# EAGLE design Wireless_Steering_v3.4 (EAGLE 6.5.0)
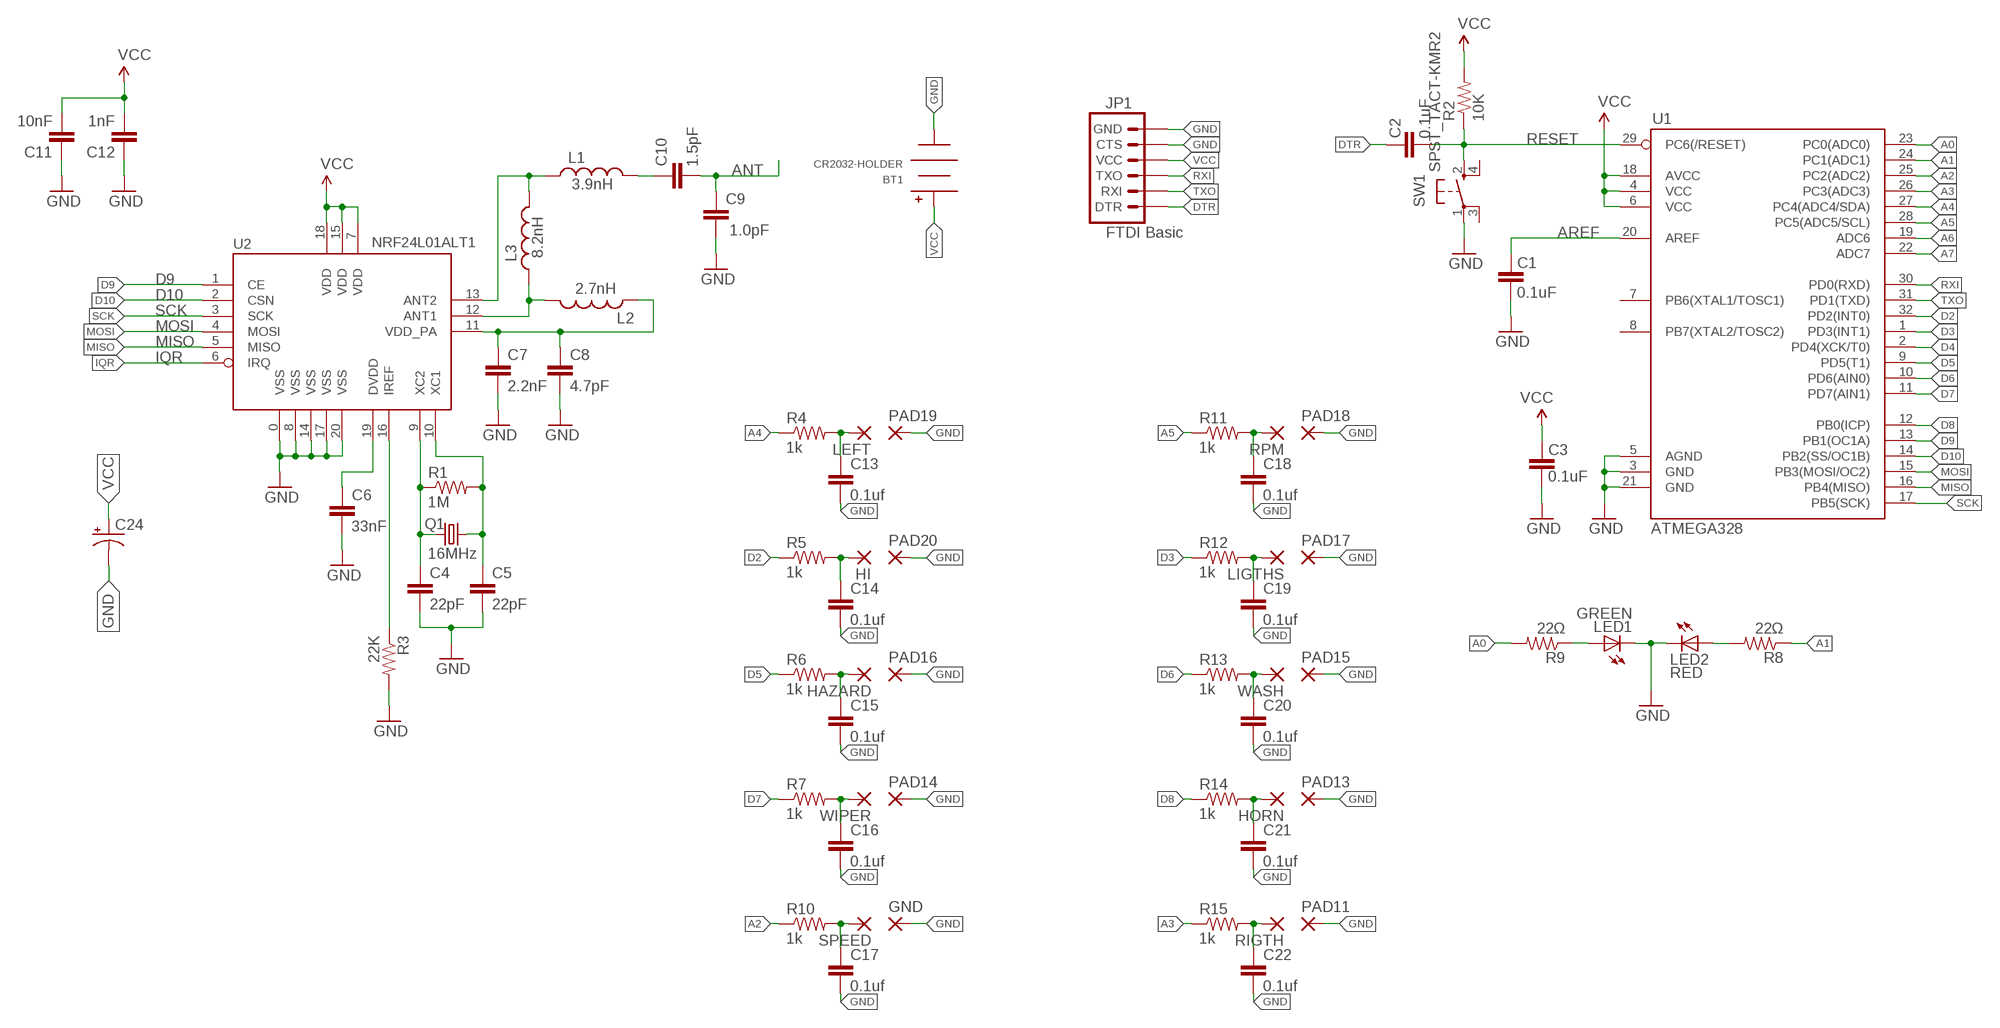
[diagram p0: schematic, sheet 1]

## Parts
BT1  CR2032-HOLDER  [CH28-2032LF]
C1  0.1uF  CAP0402-CAP  [0402-CAP]
C2  0.1uF  CAP0402-CAP  [0402-CAP]
C3  0.1uF  CAP0402-CAP  [0402-CAP]
C4  22pF  CAP0402-CAP  [0402-CAP]
C5  22pF  CAP0402-CAP  [0402-CAP]
C6  33nF  CAP0402-CAP  [0402-CAP]
C7  2.2nF  CAP0402-CAP  [0402-CAP]
C8  4.7pF  CAP0402-CAP  [0402-CAP]
C9  1.0pF  CAP0402-CAP  [0402-CAP]
C10  1.5pF  CAP0402-CAP  [0402-CAP]
C11  10nF  CAP0402-CAP  [0402-CAP]
C12  1nF  CAP0402-CAP  [0402-CAP]
C13  0.1uf  CAP0402-CAP  [0402-CAP]
C14  0.1uf  CAP0402-CAP  [0402-CAP]
C15  0.1uf  CAP0402-CAP  [0402-CAP]
C16  0.1uf  CAP0402-CAP  [0402-CAP]
C17  0.1uf  CAP0402-CAP  [0402-CAP]
C18  0.1uf  CAP0402-CAP  [0402-CAP]
C19  0.1uf  CAP0402-CAP  [0402-CAP]
C20  0.1uf  CAP0402-CAP  [0402-CAP]
C21  0.1uf  CAP0402-CAP  [0402-CAP]
C22  0.1uf  CAP0402-CAP  [0402-CAP]
C24  CAP_POL1206  [EIA3216]
GND  SMD2  [SMD1,27-2,54]
HAZARD  SMD2  [SMD1,27-2,54]
HI  SMD2  [SMD1,27-2,54]
HORN  SMD2  [SMD1,27-2,54]
JP1  FTDI Basic  ARDUINO_SERIAL_PROGRAMPTH  [1X06]
L1  3.9nH  INDUCTOR0402  [C0402]
L2  2.7nH  INDUCTOR0402  [C0402]
L3  8.2nH  INDUCTOR0402  [C0402]
LED1  GREEN  LEDCHIP-LED0603  [CHIP-LED0603]
LED2  RED  LEDCHIP-LED0603  [CHIP-LED0603]
LEFT  SMD2  [SMD1,27-2,54]
LIGTHS  SMD2  [SMD1,27-2,54]
PAD11  SMD2  [SMD1,27-2,54]
PAD13  SMD2  [SMD1,27-2,54]
PAD14  SMD2  [SMD1,27-2,54]
PAD15  SMD2  [SMD1,27-2,54]
PAD16  SMD2  [SMD1,27-2,54]
PAD17  SMD2  [SMD1,27-2,54]
PAD18  SMD2  [SMD1,27-2,54]
PAD19  SMD2  [SMD1,27-2,54]
PAD20  SMD2  [SMD1,27-2,54]
Q1  16MHz  CRYSTAL5X3  [CRYSTAL-SMD-5X3]
R1  1M  RESISTOR0402-RES  [0402-RES]
R2  10K  RESISTOR0402-RES  [0402-RES]
R3  22K  RESISTOR0402-RES  [0402-RES]
R4  1k  R-US_R0402  [R0402]
R5  1k  R-US_R0402  [R0402]
R6  1k  R-US_R0402  [R0402]
R7  1k  R-US_R0402  [R0402]
R8  22Ω  R-US_R0402  [R0402]
R9  22Ω  R-US_R0402  [R0402]
R10  1k  R-US_R0402  [R0402]
R11  1k  R-US_R0402  [R0402]
R12  1k  R-US_R0402  [R0402]
R13  1k  R-US_R0402  [R0402]
R14  1k  R-US_R0402  [R0402]
R15  1k  R-US_R0402  [R0402]
RIGTH  SMD2  [SMD1,27-2,54]
RPM  SMD2  [SMD1,27-2,54]
SPEED  SMD2  [SMD1,27-2,54]
SW1  SPST_TACT-KMR2  [KMR2]
U1  ATMEGA328  ATMEGA168  [TQFP32-08]
U2  NRF24L01ALT1  [QFN20_ALT1]
WASH  SMD2  [SMD1,27-2,54]
WIPER  SMD2  [SMD1,27-2,54]

## Nets
A0: R9.2 U1.23(PC0(ADC0))
A1: R8.1 U1.24(PC1(ADC1))
A2: R10.1 U1.25(PC2(ADC2))
A3: R15.1 U1.26(PC3(ADC3))
A4: R4.1 U1.27(PC4(ADC4/SDA))
A5: R11.1 U1.28(PC5(ADC5/SCL))
A6: U1.19(ADC6)
A7: U1.22(ADC7)
ANT: C9.2 C10.2
AREF: C1.2 U1.20(AREF)
D2: R5.1 U1.32(PD2(INT0))
D3: R12.1 U1.1(PD3(INT1))
D4: U1.2(PD4(XCK/T0))
D5: R6.1 U1.9(PD5(T1))
D6: R13.1 U1.10(PD6(AIN0))
D7: R7.1 U1.11(PD7(AIN1))
D8: R14.1 U1.12(PB0(ICP))
D9: U1.13(PB1(OC1A)) U2.1(CE)
D10: U1.14(PB2(SS/OC1B)) U2.2(CSN)
DTR: C2.2 JP1.1(DTR)
GND [vcc]: BT1.NEG C1.1 C3.1 C4.2 C5.2 C6.2 C7.2 C8.2 C9.1 C11.1 C12.1 C13.2 C14.2 C15.2 C16.2 C17.2 C18.2 C19.2 C20.2 C21.2 C22.2 C24.C(-) GND.1(P) JP1.5(CTS) JP1.6(GND) LED1.C LED2.C PAD11.1(P) PAD13.1(P) PAD14.1(P) PAD15.1(P) PAD16.1(P) PAD17.1(P) PAD18.1(P) PAD19.1(P) PAD20.1(P) R3.2 SW1.1(P) U1.3(GND) U1.5(AGND) U1.21(GND) U2.0(VSS) U2.8(VSS) U2.14(VSS) U2.17(VSS) U2.20(VSS)
IQR: U2.6(IRQ)
MISO: U1.16(PB4(MISO)) U2.5(MISO)
MOSI: U1.15(PB3(MOSI/OC2)) U2.4(MOSI)
N$1: C4.1 Q1.1 R1.1 U2.9(XC2)
N$2: C5.1 Q1.3 R1.2 U2.10(XC1)
N$8: L1.1 L3.2 U2.13(ANT2)
N$10: LED2.A R8.2
N$11: LED1.A R9.1
N$12: C7.1 C8.1 L2.1 U2.11(VDD_PA)
N$13: R3.1 U2.16(IREF)
N$14: C6.1 U2.19(DVDD)
N$15: L2.2 L3.1 U2.12(ANT1)
N$16: C10.1 L1.2
N$17: C13.1 LEFT.1(P) R4.2
N$18: C14.1 HI.1(P) R5.2
N$19: C16.1 R7.2 WIPER.1(P)
N$20: C17.1 R10.2 SPEED.1(P)
N$21: C22.1 R15.2 RIGTH.1(P)
N$22: C21.1 HORN.1(P) R14.2
N$23: C20.1 R13.2 WASH.1(P)
N$24: C19.1 LIGTHS.1(P) R12.2
N$25: C18.1 R11.2 RPM.1(P)
N$26: C15.1 HAZARD.1(P) R6.2
RESET: C2.1 R2.1 SW1.2(S) U1.29(PC6(/RESET))
RXI: JP1.3(TXO) U1.30(PD0(RXD))
SCK: U1.17(PB5(SCK)) U2.3(SCK)
TXO: JP1.2(RXI) U1.31(PD1(TXD))
VCC: BT1.POS C3.2 C11.2 C12.2 C24.A(+) JP1.4(VCC) R2.2 U1.4(VCC) U1.6(VCC) U1.18(AVCC) U2.7(VDD) U2.15(VDD) U2.18(VDD)
Unconnected: SW1.3(P1) SW1.4(S1) U1.7(PB6(XTAL1/TOSC1)) U1.8(PB7(XTAL2/TOSC2))

## Library data of the parts
BT1 = battery-holder:CR2032-HOLDER
C1-C22 = SparkFun:CAP: Capacitor Standard 0603 ceramic capacitor, and 0.1" leaded capacitor.
C24 = SparkFun-Passives:CAP_POL: Capacitor Polarized These are standard SMD and PTH capacitors. Normally 10uF, 47uF, and 100uF in electrolytic and tantalum varieties. Always verify the external diameter of the through hole cap, it varies with capacity, voltage, and manufacturer. The EIA devices should be standard.
GND HAZARD HI HORN LEFT LIGTHS PAD11 PAD13-PAD20 RIGTH RPM SPEED WASH WIPER = wirepad:SMD2: SMD PAD
JP1 = SparkFun:ARDUINO_SERIAL_PROGRAM
L1-L3 = SparkFun:INDUCTOR: Inductors Basic Inductor/Choke - 0603 and 1206. Footprints are not proven and vary greatly between part numbers.
LED1 LED2 = adafruit:LED: LED OSRAM: - CHIPLED LG R971, LG N971, LY N971, LG Q971, LY Q971, LO R971, LY R971 LH N974, LH R974 LS Q976, LO Q976, LY Q976 LO Q996 - Hyper CHIPLED LW Q18S LB Q993, LB Q99A, LB R99A - SideLED LS A670, LO A670, LY A670, LG A670, LP A670 LB A673, LV A673, LT A673, LW A673 LH A674 LY A675 LS A676, LA A676, LO A676, LY A676, LW A676 LS A679, LY A679, LG A679 - Hyper Micro SIDELED® LS Y876, LA Y876, LO Y876, LY Y876 LT Y87S - SmartLED LW L88C, LW L88S LB L89C, LB L89S, LG L890 LS L89K, LO L89K, LY L89K LS L896, LA L896, LO L896, LY L896 - TOPLED LS T670, LO T670, LY T670, LG T670, LP T670 LSG T670, LSP T670, LSY T670, LOP T670, LYG T670 LG T671, LOG T671, LSG T671 LB T673, LV T673, LT T673, LW T673 LH T674 LS T676, LA T676, LO T676, LY T676, LB T676, LH T676, LSB T676, LW T676 LB T67C, LV T67C, LT T67C, LS T67K, LO T67K, LY T67K, LW E67C LS E67B, LA E67B, LO E67B, LY E67B, LB E67C, LV E67C, LT E67C LW T67C LS T679, LY T679, LG T679 LS T770, LO T770, LY T770, LG T770, LP T770 LB T773, LV T773, LT T773, LW T773 LH T774 LS E675, LA E675, LY E675, LS T675 LS T776, LA T776, LO T776, LY T776, LB T776 LHGB T686 LT T68C, LB T68C - Hyper Mini TOPLED® LB M676 - Mini TOPLED Santana® LG M470 LS M47K, LO M47K, LY M47K Source: http://www.osram.convergy.de/
Q1 = SparkFun:CRYSTAL: Crystals Various standard crystals. Proven footprints. Spark Fun Electronics SKU : COM-00534
R1-R3 = SparkFun:RESISTOR: Resistor Basic schematic elements and footprints for 0603, 1206, and PTH resistors.
R4-R15 = adafruit:R-US_: RESISTOR, American symbol
SW1 = adafruit:SPST_TACT: SMT 6mm switch, EVQQ2 series http://www.ladyada.net/library/eagle
U1 = SparkFun:ATMEGA168
U2 = Testing:NRF24L01: 2.4GHz Low Power Transceiver This is the very popular, low cost, very low power RF transceiver from Nordic Semiconductor. Simple SPI interface. SKU: COM-00690

## Net classes
1 vcc: width 0.254 mm

## Board
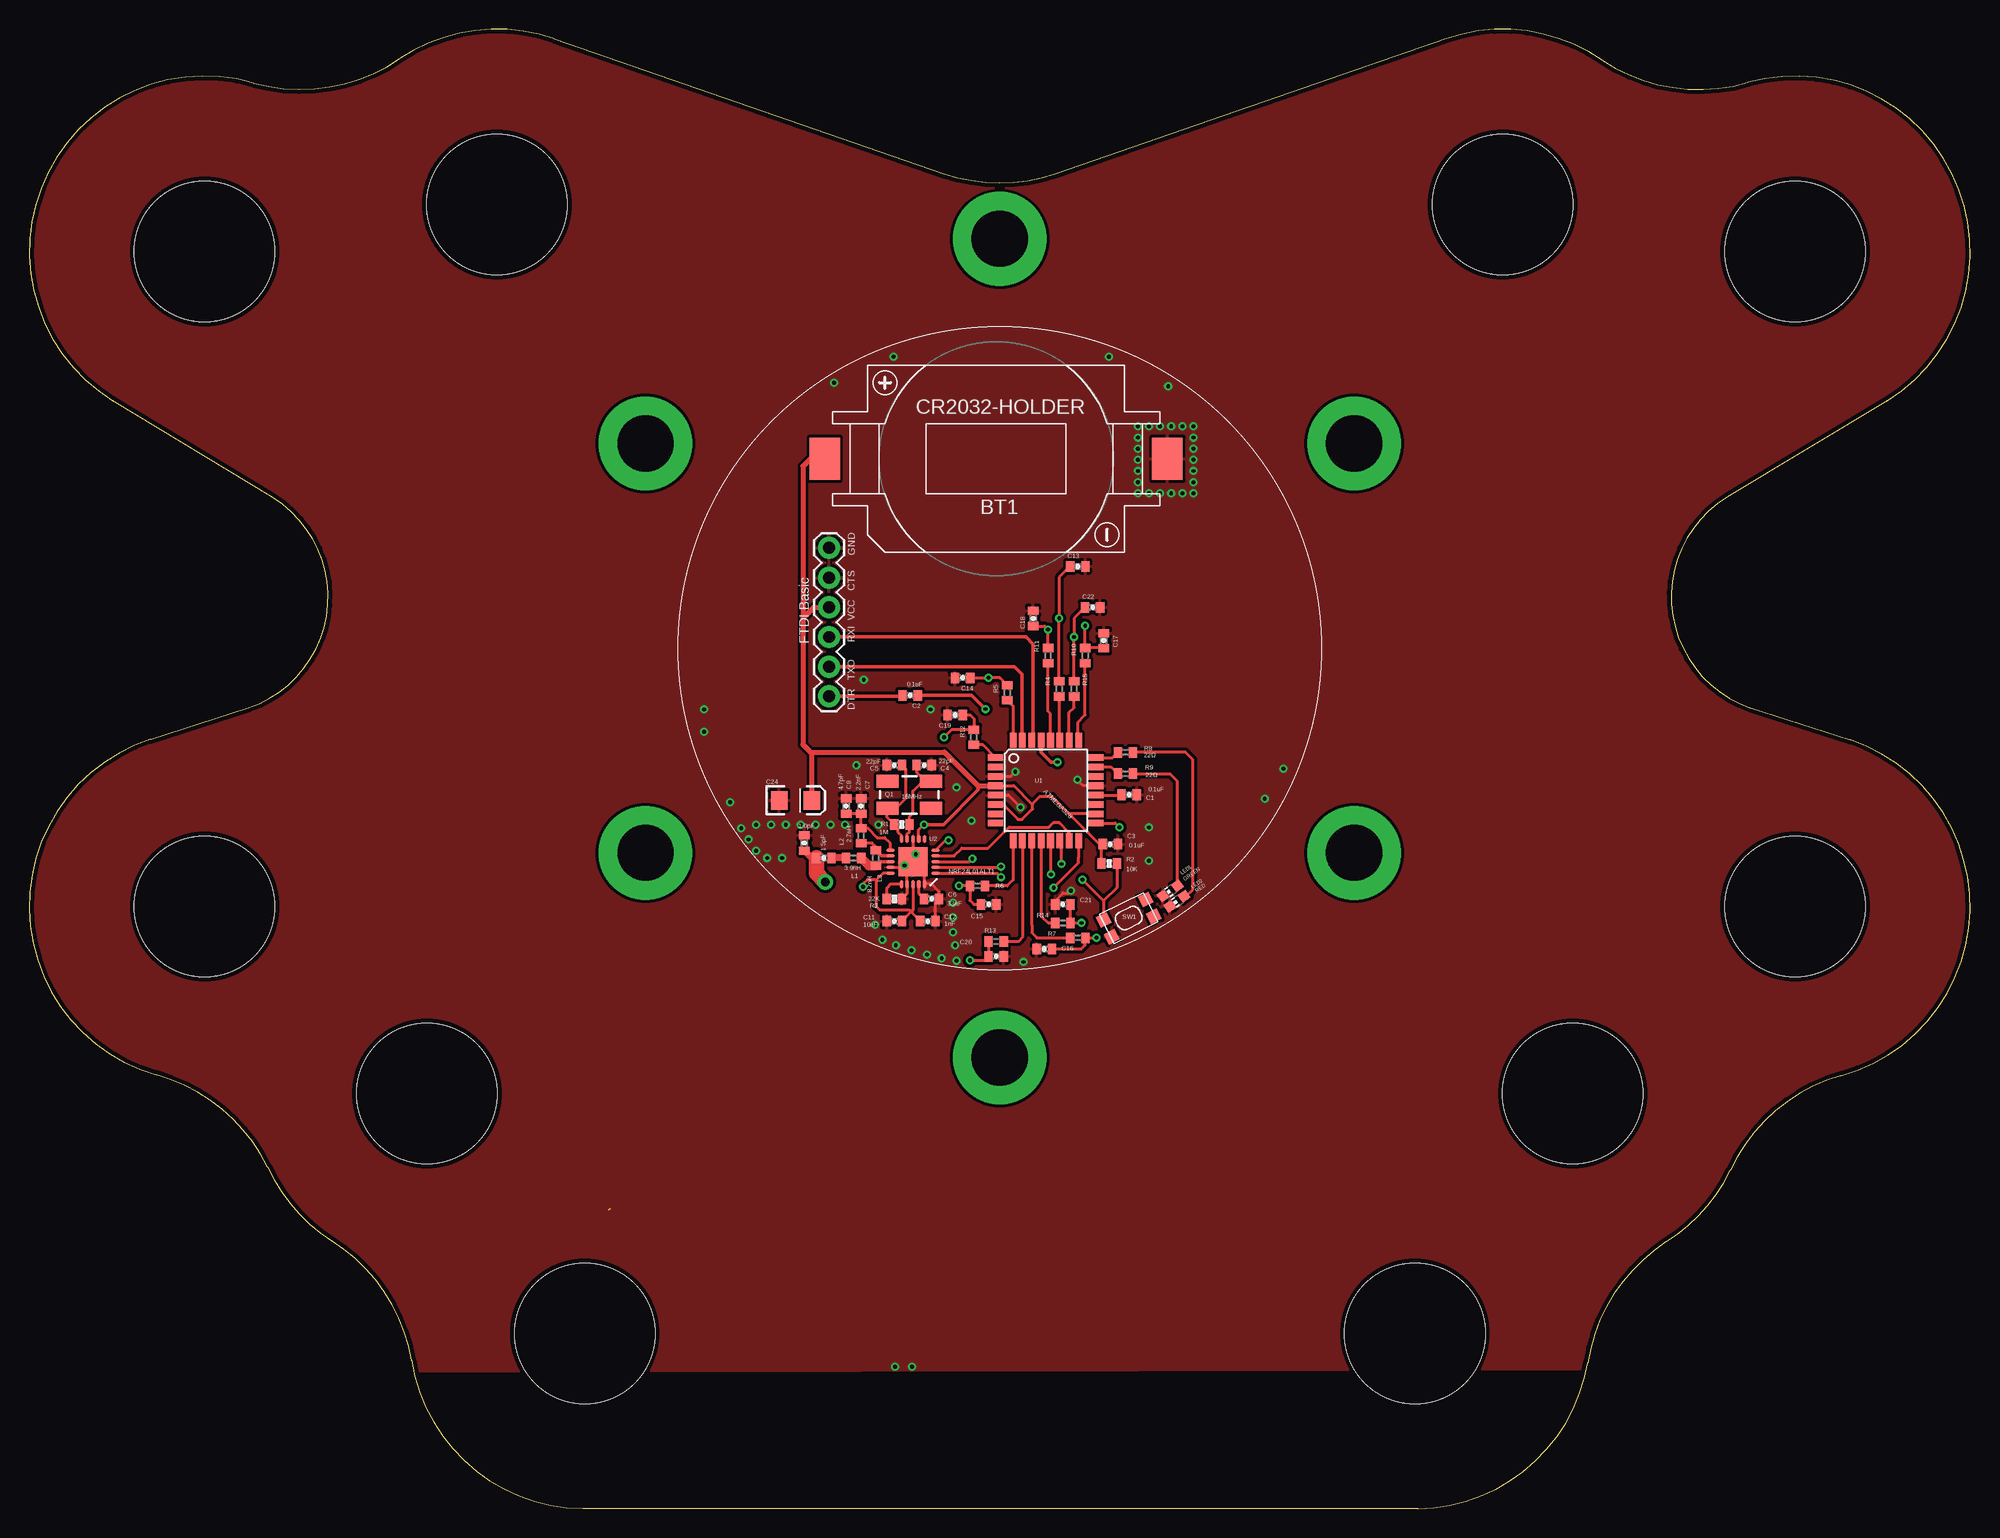
[diagram p1: board, top side]
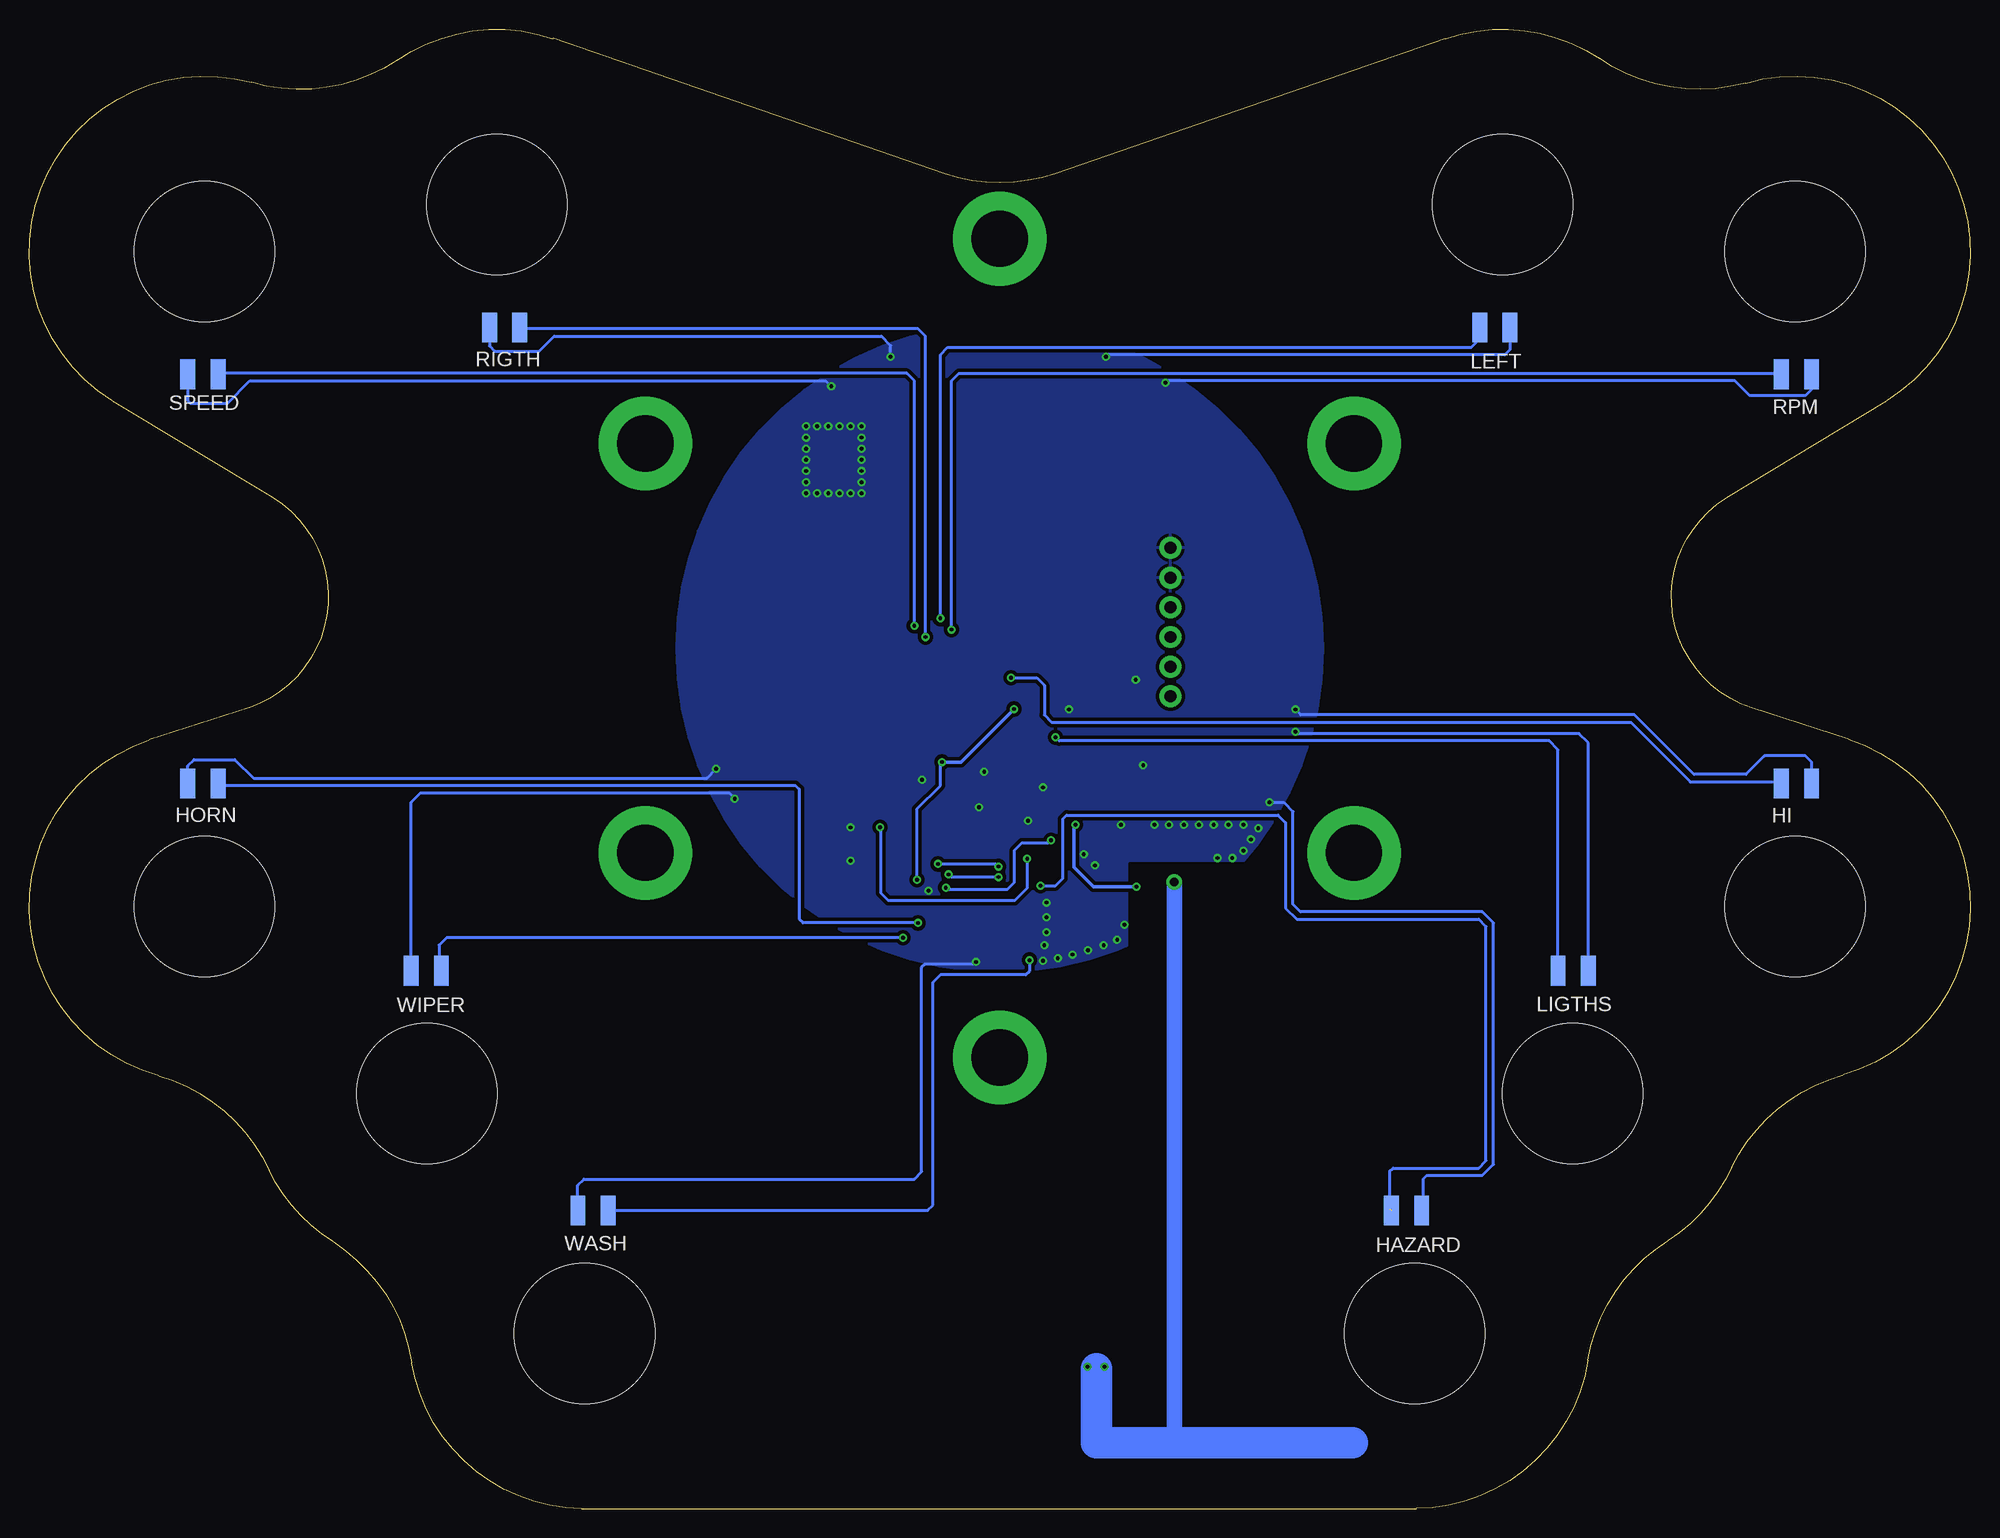
[diagram p2: board, bottom side, seen from below]

Size 166 x 126.49 mm. Coordinates in mm from the lower left corner, seen from the top.
Outline: 147.17,68.5 155.73,65.73
Outline: 121.21,125.7 87.71,114.12 arc-37 78.23,114.15 44.91,125.68 arc53 31.7,124
Outline: 47.37,0 118.74,0 arc79 133.29,12.5
Outline: 20.85,86.44 7.14,94.72
Outline: 155.72,65.73 arc-146 154.94,37.03 arc49 145.48,28.94
Outline: 7.15,94.73 arc-165 19.2,121.9 arc50 31.71,123.99
Outline: 146.99,121.95 arc-50 134.54,123.83 arc53 121.21,125.7
Outline: 146.99,121.94 arc-164 158.9,94.74 145.16,86.46 arc129 147.16,68.49
Outline: 145.48,28.94 arc-32 139.98,22.81 arc48 133.29,12.5
Outline: 47.37,0.02 arc-81 32.69,12.7 arc48 25.86,22.91
Outline: 25.86,22.91 arc-32 20.4,29.19 arc49 10.87,37.09
Outline: 10.87,37.09 arc-146 10.39,65.79 18.74,68.48 arc130 20.85,86.43
Copper layers (1*16): Top 0.0356mm / dielectric 1.5011mm / Bottom 0.0356mm
Design rules "oshpark-2layer": minimum track width 6mil, minimum drill 13mil, track to track 6mil, track to pad 6mil, pad to pad 6mil, via to via 6mil, smd to smd 6mil, copper to edge 15mil, drill to drill 6mil, minimum pad ring 7mil, minimum via ring 7mil, stop-mask expansion 2.5mil, vias tented up to drill 0mil, thermal gap 10mil
Holes 12 mm at 15,107.5 40,111.5 126,111.5 151,107.5 151,51.5 132,35.5 15,51.5 34,35.5 47.5,15 118.5,15

### Footprints (pad centres in the part's own frame; a part is rotated, then mirrored left to right if it is on the bottom)
CH28-2032LF = smd 3.6 x 2.6: NEG 0,-14.65; POS 0,14.65
0402-CAP = smd 0.7 x 0.9: 1 -0.65,0; 2 0.65,0
EIA3216 = smd 1.4 x 1.6: A 1.4,0; C -1.4,0
SMD1,27-2,54 = smd 1.27 x 2.54: 1 0,0
1X06 = drill 1.016 pad 1.88: 1 0,0; 2 2.54,0; 3 5.08,0; 4 7.62,0; 5 10.16,0; 6 12.7,0
C0402 = smd 0.7 x 0.9: 1 -0.65,0; 2 0.65,0
CHIP-LED0603 = smd 0.8 x 0.8: A 0,-0.75; C 0,0.75
CRYSTAL-SMD-5X3 = smd 1.9 x 1.1: 1 -1.85,-1.15; 2 1.85,-1.15; 3 1.85,1.15; 4 -1.85,1.15
0402-RES = smd 0.7 x 0.9: 1 -0.65,0; 2 0.65,0
R0402 = smd 0.7 x 0.9: 1 -0.65,0; 2 0.65,0
KMR2 = smd 1 x 1: 1 2,0.8; 2 2,-0.8; 3 -2,0.8; 4 -2,-0.8
TQFP32-08 = smd 1.27 x 0.559: 1 -4.293,2.8; 2 -4.293,2; 3 -4.293,1.2; 4 -4.293,0.4; 5 -4.293,-0.4; 6 -4.293,-1.2; 7 -4.293,-2; 8 -4.293,-2.8; 17 4.293,-2.8; 18 4.293,-2; 19 4.293,-1.2; 20 4.293,-0.4; 21 4.293,0.4; 22 4.293,1.2; 23 4.293,2; 24 4.293,2.8 | smd 0.559 x 1.27: 9 -2.8,-4.293; 10 -2,-4.293; 11 -1.2,-4.293; 12 -0.4,-4.293; 13 0.4,-4.293; 14 1.2,-4.293; 15 2,-4.293; 16 2.8,-4.293; 25 2.8,4.293; 26 2,4.293; 27 1.2,4.293; 28 0.4,4.293; 29 -0.4,4.293; 30 -1.2,4.293; 31 -2,4.293; 32 -2.8,4.293
QFN20_ALT1 = smd 2.515 x 2.515: 0 0,0 | smd 0.686 x 0.293: 1 -1.925,0.986; 2 -1.925,0.493; 3 -1.925,0; 4 -1.925,-0.493; 5 -1.925,-0.986; 11 1.925,-0.986; 12 1.925,-0.493; 13 1.925,0; 14 1.925,0.493; 15 1.925,0.986 | smd 0.293 x 0.686: 6 -0.986,-1.925; 7 -0.493,-1.925; 8 0,-1.925; 9 0.493,-1.925; 10 0.986,-1.925; 16 0.986,1.925; 17 0.493,1.925; 18 0,1.925; 19 -0.493,1.925; 20 -0.986,1.925

### Placement (x,y rotation side)
BT1  82.68,89.77 90 top
C1  94.06,61.05 180 top
C2  75.34,69.55 180 top
C3  92.45,56.82 180 top
C4  76.53,63.57 0 top
C5  73.99,63.57 180 top
C6  77.17,52.14 0 top
C7  71.14,60.08 90 top
C8  69.86,60.08 90 top
C9  66.29,56.92 270 top
C10  67.96,55.64 180 top
C11  73.99,50.24 0 top
C12  76.85,50.24 180 top
C13  89.67,80.56 0 top
C14  79.82,71.04 180 top
C15  82.05,51.67 0 top
C16  86.81,47.86 180 top
C17  91.89,74.22 90 top
C18  85.86,76.12 90 top
C19  79.19,67.86 180 top
C20  82.68,47.23 0 top
C21  88.4,51.67 180 top
C22  90.94,77.07 0 top
C24  65.54,60.56 0 top
GND  13.57,97 0 bottom
HAZARD  49.5,25.5 0 bottom
HI  16.15,62 0 bottom
HORN  149.85,62 0 bottom
JP1  68.39,69.45 90 top
L1  70.5,55.64 180 top
L2  71.14,57.54 270 top
L3  72.4,55.64 270 top
LED1  97.57,52.83 125 top
LED2  98.15,51.93 125 top
LEFT  41.95,101 0 bottom
LIGTHS  35.25,46 0 bottom
PAD11  119.08,25.5 0 bottom
PAD13  133.33,46 0 bottom
PAD14  152.43,62 0 bottom
PAD15  13.57,62 0 bottom
PAD16  32.67,46 0 bottom
PAD17  46.92,25.5 0 bottom
PAD18  152.43,97 0 bottom
PAD19  126.63,101 0 bottom
PAD20  39.37,101 0 bottom
Q1  75.26,61.03 180 top
R1  74.63,58.49 180 top
R2  92.36,55.16 180 top
R3  73.99,52.14 0 top
R4  88.08,70.09 90 top
R5  83.63,69.77 90 top
R6  81.09,53.26 180 top
R7  89.67,48.81 0 top
R8  93.75,64.67 0 top
R9  93.75,62.84 180 top
R10  90.3,72.94 90 top
R11  87.13,72.94 90 top
R12  80.78,65.96 90 top
R13  82.68,48.5 180 top
R14  88.4,50.09 0 top
R15  89.35,70.09 90 top
RIGTH  124.05,101 0 bottom
RPM  16.15,97 0 bottom
SPEED  149.85,97 0 bottom
SW1  94.03,50.5 206 top
U1  86.94,61.42 0 top
U2  75.58,55.32 180 top
WASH  116.5,25.5 0 bottom
WIPER  130.75,46 0 bottom

### Tracks (layer width: path | path; a pad name or v marks a point on that pad's centre or on a via)
A0
  Top 0.254: U1.23 91.25,63.44 92.5,63.44 R9.2
A1
  Top 0.254: U1.24 92.64,64.22 R8.1
A2
  Top 0.254: U1.25 89.67,65.78 89.67,67.23 90.3,67.86 R10.1
A3
  Top 0.254: U1.26 88.94,68.09 89.35,68.5 R15.1
A4
  Top 0.254: R4.1 88.08,65.76 U1.27
A5
  Top 0.254: U1.28 87.34,67.97 87.13,68.18 R11.1
ANT  (via drill 0.7 pad 1.35)
  Top 0.61: C10.2 66.92,55.64 C9.2
  Top 1.346: C10.2 67.31,54.35 v68.08,53.58
  Bottom 1.346: 68.08,5.63 v68.08,53.58
  Bottom 2.7: 52.84,5.63 68.08,5.63 74.74,5.63 74.74,11.98
AREF
  Top 0.254: U1.20 93.18,61.02 C1.2
D2
  Top 0.254: 84.14,66.01 U1.32 84.14,68.62 R5.1
D3
  Top 0.254: U1.1 81.55,65.31 R12.1
D5
  Top 0.254: U1.9 84.14,53.76 83.63,53.26 R6.1
D6
  Top 0.254: U1.10 84.94,48.85 84.59,48.5 R13.1
D7
  Top 0.254: U1.11 85.74,49.89 85.74,49.25 86.17,48.81 R7.1
D8
  Top 0.254: U1.12 86.54,51.31 86.54,50.68 87.13,50.09 R14.1
D9  (via drill 0.33)
  Top 0.254: U2.1 82.79,54.33 v83.12,54.01 | v87.38,54.23 87.38,57.07 U1.13
  Bottom 0.254: v83.12,54.01 87.16,54.01 v87.38,54.23
D10  (via drill 0.33)
  Top 0.254: U2.2 83.04,54.83 v83.12,54.91 | v88.28,55.13 88.28,56.98 U1.14
  Bottom 0.254: v88.28,55.13 83.34,55.13 v83.12,54.91
DTR
  Top 0.305: C2.2 74.39,69.45 JP1.1
GND  (via drill 0.33)
  Top 0.254: R3.2 75.09,52.59 U2.17 75.09,54.83 | C12.1 77.5,51.83 C6.2 77.82,52.76 77.17,53.41 76.59,53.41 U2.20 76.57,54.33 U2.0 | 75.09,54.83 U2.0 | U2.14 75.09,54.83 | U2.8 U2.0 | U1.3 83.93,62.62 v84.33,63.01 | U1.5 83.74,61.02 v84.78,59.98 | U1.21 90.13,61.81 v89.63,62.31 | C21.2 87.75,51.98 88.4,52.62 88.86,52.62 v89.09,52.85
  Bottom 0.254: PAD20.1 39.37,99.11 39.82,98.66 73.75,98.66 v73.91,98.5 | GND.1 13.57,95.7 14.1,95.17 18.86,95.17 20.13,96.44 68.67,96.44 v68.83,96.28 | PAD19.1 126.63,99.43 126.18,98.98 122.37,98.98 121.1,100.25 93.12,100.25 92.32,99.45 v92.32,98.5 | PAD18.1 152.43,94.75 152.21,94.53 149.04,94.53 147.13,96.44 97.89,96.44 v97.4,95.96 | PAD14.1 152.43,63.52 151.9,64.06 148.4,64.06 146.82,62.47 108.04,62.47 v107.25,63.26 | PAD13.1 133.33,60.4 132.53,61.2 106.14,61.2 v105.66,60.72 | v59.94,60.4 58.71,60.4 57.92,59.61 57.92,51.67 57.28,51.04 41.72,51.04 40.77,50.09 40.77,29.45 41.72,28.49 46.49,28.49 46.8,28.18 46.8,25.62 PAD17.1 | PAD15.1 13.57,63.84 14.1,64.37 17.59,64.37 19.18,62.78 23.63,62.78 28.71,67.86 57.24,67.86 v57.72,68.34 | PAD16.1 32.67,65.48 33.47,66.28 57.56,66.28 v57.72,66.43 | PAD11.1 119.08,27.66 118.56,28.18 90.3,28.18 89.67,28.81 89.67,46.27 89.35,46.59 85.18,46.59 v85.02,46.75
  other vias: 80.58,58.81 95.76,58.25 95.76,55.39 79.31,61.67 71.37,70.88 77.08,68.34 70.73,63.57 74.11,48.18 68.51,58.49 75.81,55.95 74.86,55 78.99,50.56 76.77,47.38 78.04,47.06 78.99,49.29 79.31,46.85 72.96,48.65 60.89,58.18 61.53,57.22 62.16,56.27 63.11,55.64 64.38,55.64 62.16,58.49 63.43,58.49 64.7,58.49 97.66,86.82 98.61,86.82 99.57,86.82 99.57,87.77 99.57,88.73 99.57,89.68 99.57,90.63 99.57,91.58 99.57,92.54 98.61,92.54 97.66,92.54 96.71,92.54 95.76,92.54 94.8,92.54 94.8,91.58 94.8,90.63 94.8,89.68 94.8,88.73 94.8,87.77 94.8,86.82 95.76,86.82 96.71,86.82 75.45,47.75 79.19,48.18 74.05,12.14 75.5,12.14 65.97,58.49 67.24,58.49 69.78,58.49 72.32,49.92 78.99,51.83 72.64,58.49
  pour Top (isolate 0.305, rank 2): 82.88,101.2 83.12,101.2 arc-90
  pour Bottom (isolate 0.305, rank 2): 83.12,45.96 82.88,45.96 arc-90 55.38,73.46 55.38,73.7 arc-90 82.88,101.2 83.12,101.2 arc-90 110.62,73.7 110.62,73.46 arc-90
  pour Top (isolate 0.254, rank 2): -0.19,126.6 166.18,126.92 166.18,11.98 -0.19,11.67
MISO  (via drill 0.33)
  Top 0.254: v78.63,57.15 78.35,57.15 U2.5 | U1.16 89.74,55.68 89.74,55.23 v87.61,53.11
  Bottom 0.254: v78.63,57.15 78.85,56.92 81.1,56.92 81.77,56.25 81.77,53.53 82.36,52.94 87.44,52.94 v87.61,53.11
MOSI
  Top 0.254: U1.15 88.94,57.8 88.1,58.63 87.56,58.63 87.2,58.27 83.79,58.27 82,56.48 79.75,56.48 79.09,55.81 U2.4
N$1
  Top 0.254: U2.9 75.09,57.68 75.26,57.86 75.26,58.48 R1.1 75.28,59.14 75.58,59.45 75.58,61.35 76.53,62.3 | 76.53,62.3 76.99,62.3 Q1.1 | C4.1 75.88,62.95 76.53,62.3
N$2
  Top 0.254: U2.10 74.59,57.58 74.31,57.86 74.31,58.16 R1.2 73.98,58.51 73.36,59.13 73.36,59.83 Q1.3 73.61,60.08 74.31,60.08 74.94,60.72 74.94,63.26 C5.1
N$3  (via drill 4.8 pad 8)
  other vias: 83,108.58
N$4  (via drill 4.8 pad 8)
  other vias: 113.3,91.08
N$5  (via drill 4.8 pad 8)
  other vias: 52.7,91.08
N$6  (via drill 4.8 pad 8)
  other vias: 52.7,56.08
N$7  (via drill 4.8 pad 8)
  other vias: 113.3,56.08
N$8
  Top 0.254: 72.42,55 L3.2
  Top 0.305: U2.13 72.74,55.32 L3.2
  Top 0.813: L3.2 71.8,54.99 L1.1
N$9  (via drill 4.8 pad 8)
  other vias: 83,38.58
N$10
  Top 0.254: LED2.A 98.93,52.36 99.51,52.94 99.51,64.06 98.87,64.69 94.42,64.69 R8.2
N$11
  Top 0.254: LED1.A 98.19,62.2 97.6,62.78 94.46,62.78 R9.1
N$12
  Top 0.254: C8.1 C7.1 L2.1 71.72,58.19 72.52,57.39 73.16,57.39 73.65,56.89 U2.11
N$13
  Top 0.254: R3.1 73.34,53.08 73.67,53.41 74.57,53.41 U2.16
N$14
  Top 0.254: U2.19 76.07,52.59 C6.1
N$15
  Top 0.254: L3.1 72.4,56.59 72.09,56.91 71.15,56.91 L2.2
  Top 0.305: U2.12 72.88,55.81 L3.1
N$16
  Top 0.61: L1.2 C10.1
N$17  (via drill 0.33)
  Top 0.254: R4.2 v88.08,76.12 88.08,79.63 C13.1
  Bottom 0.254: v88.08,76.12 88.08,98.66 87.44,99.3 42.68,99.3 42.04,99.93 42.04,100.91 LEFT.1
N$18  (via drill 0.33)
  Top 0.254: R5.2 83.62,70.42 83,71.04 v82.05,71.04 C14.1
  Bottom 0.254: v82.05,71.04 79.82,71.04 79.19,70.41 79.19,67.86 78.55,67.23 29.02,67.23 23.94,62.15 16.3,62.15 HI.1
N$19  (via drill 0.33)
  Top 0.254: v91.25,48.81 R7.2 90.3,48.8 90.3,48.18 89.98,47.86 C16.1
  Bottom 0.254: 130.62,45.88 WIPER.1 | 130.62,46.12 WIPER.1 | v91.25,48.81 130.31,48.81 130.94,48.18 130.94,46.19 WIPER.1
N$20  (via drill 0.33)
  Top 0.254: v90.3,75.48 R10.2 91.86,73.59 C17.1
  Bottom 0.254: v90.3,75.48 90.3,96.44 90.94,97.08 149.77,97.08 SPEED.1
N$21  (via drill 0.33)
  Top 0.254: R15.2 v89.35,74.53 89.35,76.14 C22.1
  Bottom 0.254: v89.35,74.53 89.35,100.25 89.98,100.88 123.93,100.88 RIGTH.1
N$22  (via drill 0.33)
  Top 0.254: v89.98,50.09 R14.2 C21.1
  Bottom 0.254: v89.98,50.09 99.83,50.09 100.14,50.4 100.14,61.52 100.46,61.83 149.68,61.83 HORN.1
N$23  (via drill 0.33)
  Top 0.254: R13.2 C20.1 81.71,46.91 v80.46,46.91
  Bottom 0.254: WASH.1 89.17,25.5 88.71,25.95 88.71,45 88.08,45.64 80.78,45.64 80.46,45.96 v80.46,46.91
N$24  (via drill 0.33)
  Top 0.254: v78.24,65.96 78.89,66.61 R12.2 80.78,67.55 80.46,67.86 C19.1
  Bottom 0.254: LIGTHS.1 35.25,64.88 36.01,65.64 77.92,65.64 v78.24,65.96
N$25  (via drill 0.33)
  Top 0.254: R11.2 v87.13,75.17 86.82,75.47 C18.1
  Bottom 0.254: v87.13,75.17 87.13,96.44 86.49,97.08 16.22,97.08 RPM.1
N$26  (via drill 0.33)  (1 unrouted)
  Top 0.254: v79.51,53.26 R6.2 80.44,52 80.78,51.67 C15.1
  Bottom 0.254: v79.51,53.26 78.24,53.26 77.6,53.89 77.6,58.98 77.28,59.29 59.19,59.29 58.55,58.66 58.55,51.36 57.6,50.4 42.04,50.4 41.41,49.77 41.41,29.77 42.04,29.13 49.34,29.13 49.66,28.81 49.66,25.66
N$28
  cutout Bottom: 62.04,55.16 71.89,55.16 71.89,48.18
RESET  (via drill 0.33)
  Top 0.254: v90.08,53.78 91.88,51.98 | 91.88,51.98 SW1.2 | R2.1 93.01,53.11 91.88,51.98
  Top 0.305: v87.92,63.84 87.38,63.84 86.54,64.69 U1.29 | C2.1 80.6,69.55 v81.77,68.38
  Bottom 0.254: v90.08,53.78 90.08,59.83 88.08,61.83 88.08,63.68 v87.92,63.84
  Bottom 0.305: v81.77,68.38 86.31,63.84 v87.92,63.84
RXI
  Top 0.305: U1.30 85.86,65.83 85.86,73.9 85.22,74.53 JP1.3
SCK  (via drill 0.33)
  Top 0.254: U1.17 92.88,58.62 v93.22,58.27 | U2.3 80.39,55.32 v80.65,55.58
  Bottom 0.254: v80.65,55.58 80.65,53.07 81.73,51.99 92.52,51.99 93.16,52.62 93.16,58.21 v93.22,58.27
TXO
  Top 0.305: U1.31 84.9,65.74 84.9,71.36 84.27,71.99 JP1.2
VCC  (via drill 0.33)
  Top 0.254: 88.94,59.41 89,59.41 89,59.35 | 89,59.35 88.94,59.41 | 88.94,59.41 87.47,60.88 86.4,60.88 85.77,60.25 | 85.77,60.25 85.81,60.2 85.81,59.84 84.91,58.95 84.56,58.95 83.29,60.22 U1.6 | 85.77,60.25 84.2,61.81 U1.4 | 89,59.35 90.55,57.8 91.53,56.82 C3.2 91.71,56.74 R2.2 | U1.18 88.94,59.41 | 82.63,61.83 U1.4 | 82.5,61.96 U1.4 | U2.18 75.58,51.18 75.43,51.02 | 75.43,51.02 C11.2 | C12.2 76.2,50.25 75.43,51.02 | U2.15 73,54.33 72.4,53.73 | 72.4,53.73 72.4,51.51 72.72,51.19 75.26,51.19 75.43,51.02 | U2.7 76.07,58.03 v76.53,58.49 | 72.4,53.73 72.35,53.78 71.67,53.78 71.31,53.43 v71.31,53.18
  Top 0.305: v76.53,58.49 78.18,58.49 81.15,61.46 81.15,61.81
  Top 0.406: U1.4 81.15,61.81 78.27,64.69 66.81,64.69 | 66.17,76.12 67.12,77.07 JP1.4 | 66.17,76.12 66.17,65.33 66.65,64.85 66.81,64.69 | BT1.POS 66.81,89.77 66.17,89.14 66.17,76.12 | C24.A 66.94,64.56 66.81,64.69
  Bottom 0.305: v76.53,58.49 76.65,58.38 76.65,54.85 74.98,53.18 v71.31,53.18

### Text on the board
tNames: GND | CTS | VCC | RXI | TXO | DTR | C5 | C4 | C8 | C7 | Q1 | R1 | U2 | L2 | L3 | L1 | C6 | R3 | C12 | SW1